# Altium schematic sheet SX1278.SchDoc
size A2
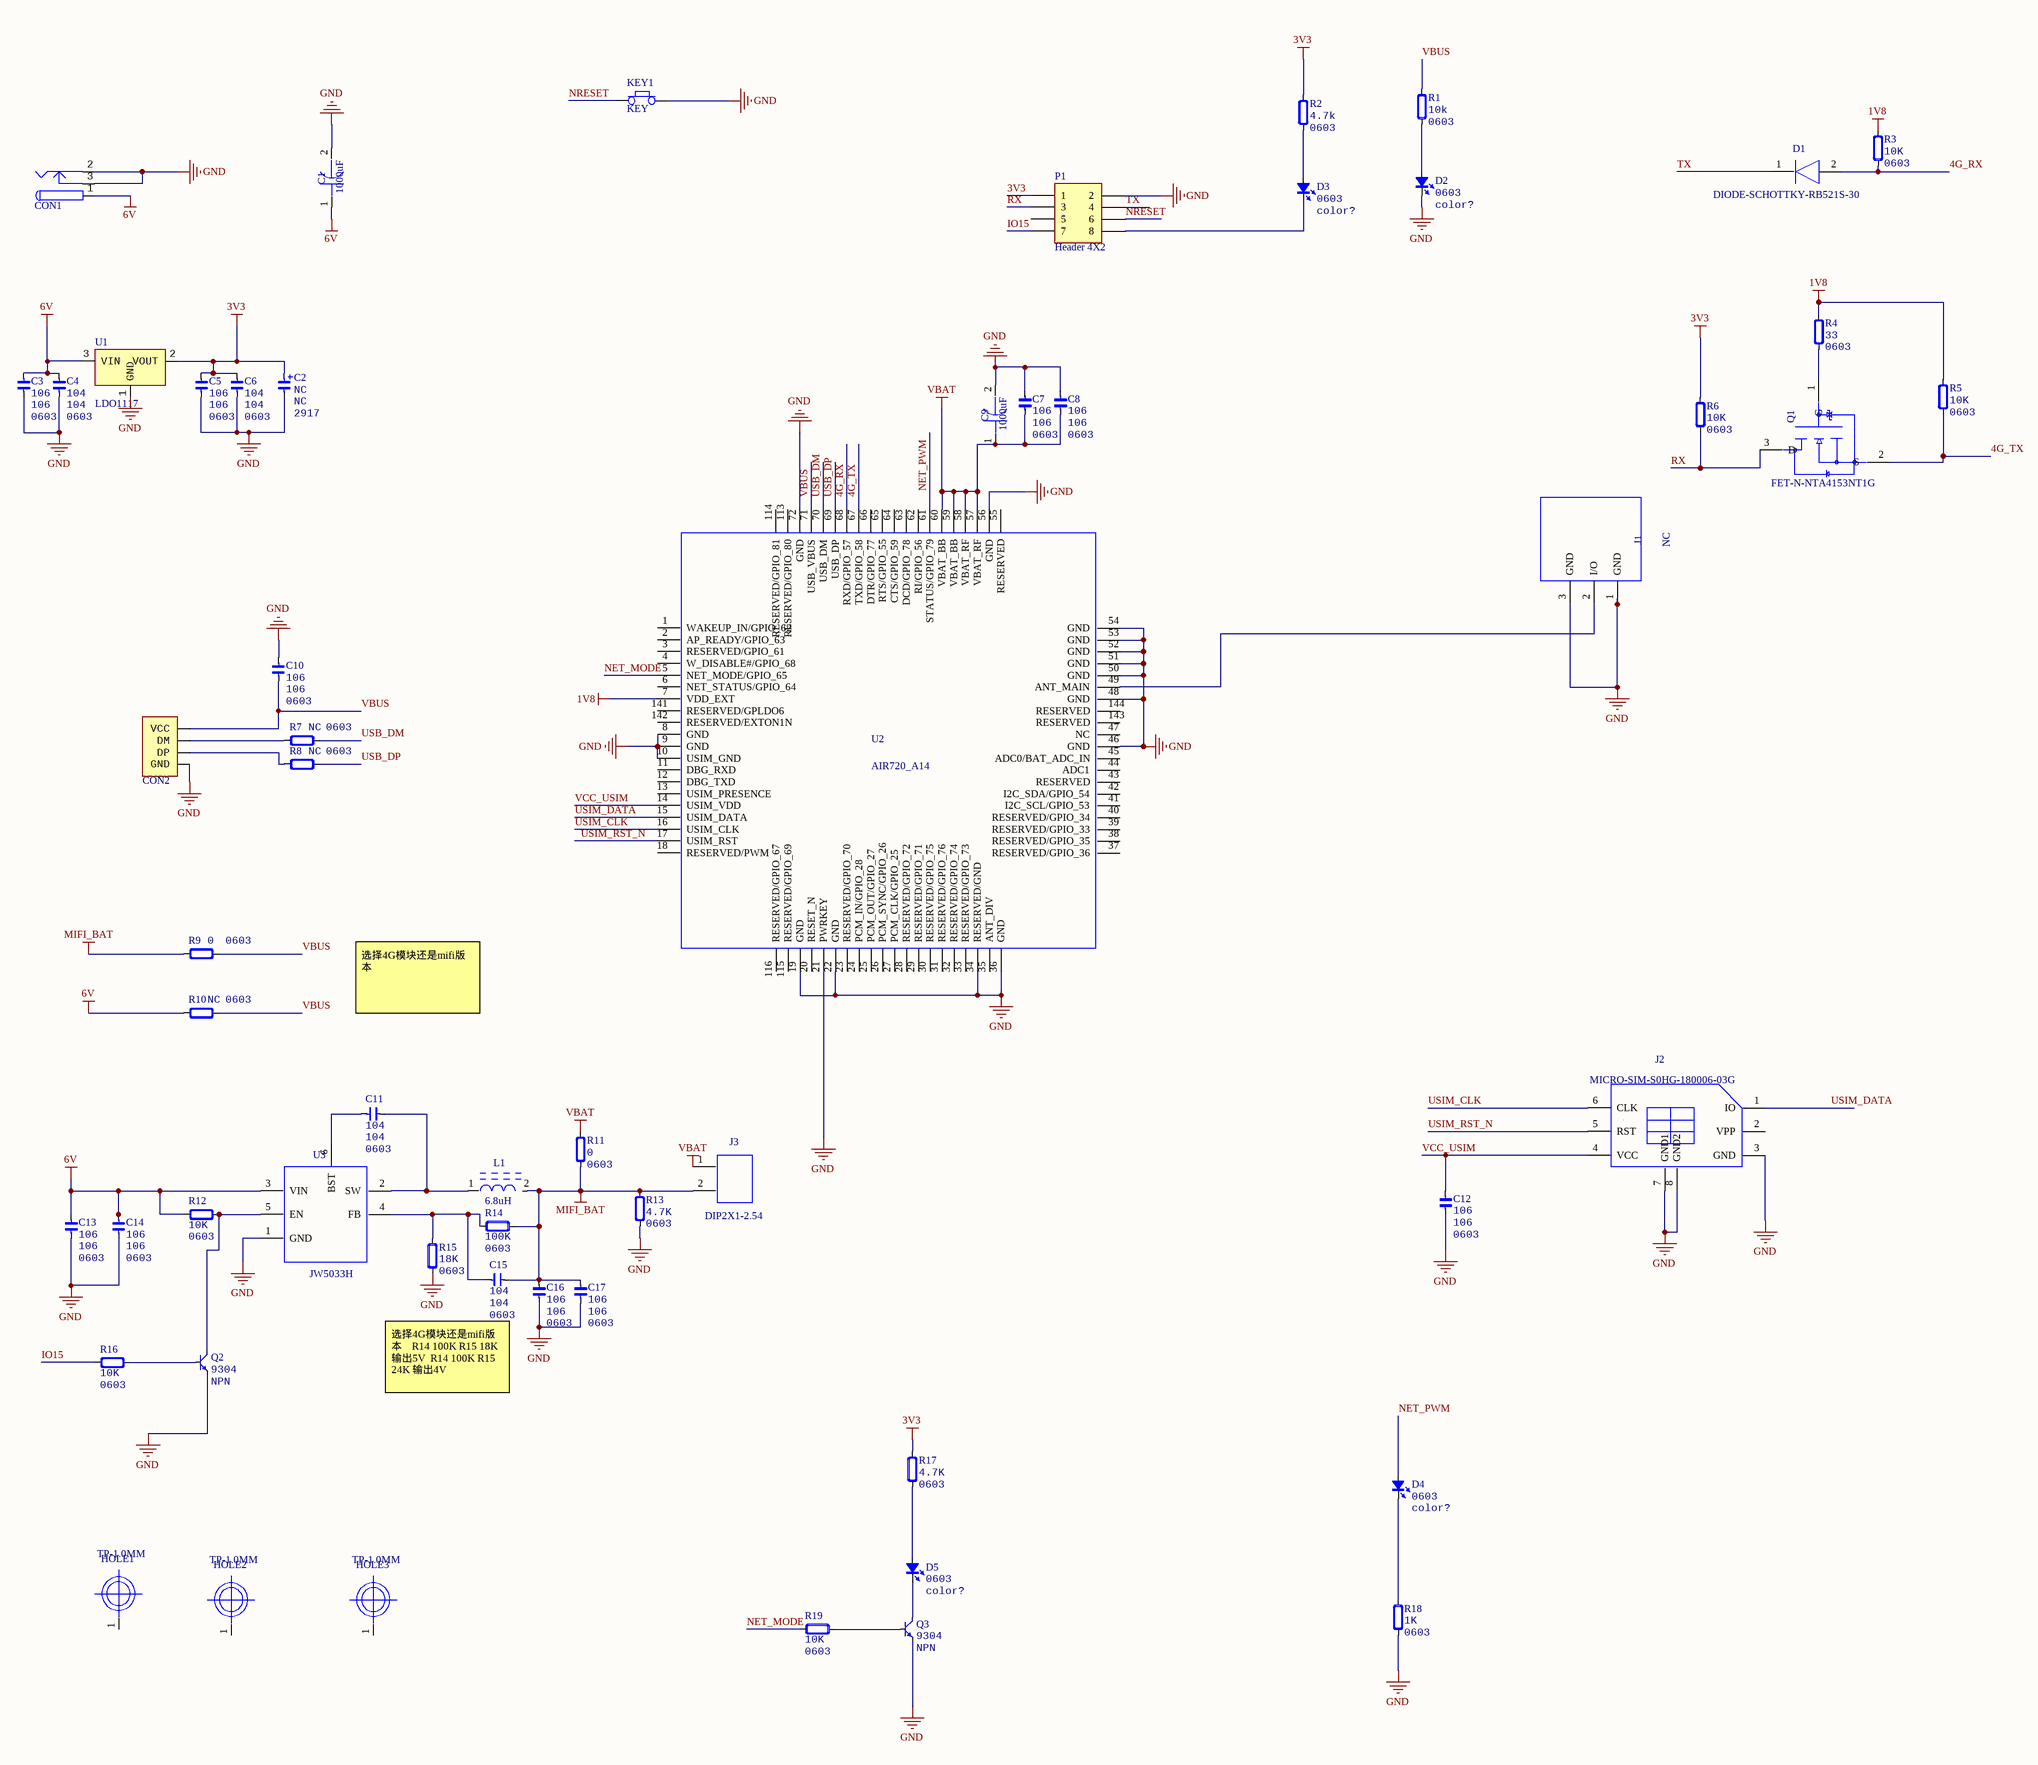
[diagram p0: SX1278.SchDoc]

## Parts
C1  value 1000uF  [CAP-AL-1000UF-10X12]  (hidden comment: CAP-AL-1000UF-8X10.5)
C2  NC  Type: 2917  [CAP_TAN_D2917]
C3  106  Type: 0603  [CAP_0603]
C4  104  Type: 0603  [CAP_0603]
C5  106  Type: 0603  [CAP_0603]
C6  104  Type: 0603  [CAP_0603]
C7  106  Type: 0603  [CAP_0603]
C8  106  Type: 0603  [CAP_0603]
C9  value 1000uF  [CAP-AL-1000UF-10X12]  (hidden comment: CAP-AL-1000UF-8X10.5)
C10  106  Type: 0603  [CAP_0603]
C11  104  Type: 0603  [CAP_0603]
C12  106  Type: 0603  [CAP_0603]
C13  106  Type: 0603  [CAP_0603]
C14  106  Type: 0603  [CAP_0603]
C15  104  Type: 0603  [CAP_0603]
C16  106  Type: 0603  [CAP_0603]
C17  106  Type: 0603  [CAP_0603]
CON1  PowerJack_2.5  [DC003A]  (value not drawn)
CON2  USB_TypeA  [USB_TypeA]  (value not drawn)
D1  DIODE-SCHOTTKY-RB521S-30  [SOD523(RB521S)]
D2  Type: 0603  [LED_0603_GREEN]  (hidden comment: color?)
D3  Type: 0603  [LED_0603_GREEN]  (hidden comment: color?)
D4  Type: 0603  [LED_0603_GREEN]  (hidden comment: color?)
D5  Type: 0603  [LED_0603_GREEN]  (hidden comment: color?)
HOLE1  TP-1.0MM  [TP-1MM]
HOLE2  TP-1.0MM  [TP-1MM]
HOLE3  TP-1.0MM  [TP-1MM]
J1  NC  [RF-ANT-HJ]
J2  MICRO-SIM-S0HG-180006-03G  [S0HG-180006-03G]
J3  DIP2X1-2.54  [DIP2X1-2.54]
KEY1  KEY  [key_4]
L1  value 6.8uH  [LVS505020-4R7M-N]  (hidden comment: LVS505020-4R7M-N)
P1  Header 4X2  [HDR2X4]
Q1  FET-N-NTA4153NT1G  [SOT23-3]
Q2  Type: NPN  [SOT23-3]  (hidden comment: 9304)
Q3  Type: NPN  [SOT23-3]  (hidden comment: 9304)
R1  Type: 0603  [RES_0603]  (hidden comment: 10k)
R2  Type: 0603  [RES_0603]  (hidden comment: 4.7k)
R3  Type: 0603  [RES_0603]  (hidden comment: 10K)
R4  Type: 0603  [RES_0603]  (hidden comment: 33)
R5  Type: 0603  [RES_0603]  (hidden comment: 10K)
R6  Type: 0603  [RES_0603]  (hidden comment: 10K)
R7  Type: 0603  [RES_0603]  (hidden comment: NC)
R8  Type: 0603  [RES_0603]  (hidden comment: NC)
R9  Type: 0603  [RES_0603]  (hidden comment: 0)
R10  Type: 0603  [RES_0603]  (hidden comment: NC)
R11  Type: 0603  [RES_0603]  (hidden comment: 0)
R12  Type: 0603  [RES_0603]  (hidden comment: 10K)
R13  Type: 0603  [RES_0603]  (hidden comment: 4.7K)
R14  Type: 0603  [RES_0603]  (hidden comment: 100K)
R15  Type: 0603  [RES_0603]  (hidden comment: 18K)
R16  Type: 0603  [RES_0603]  (hidden comment: 10K)
R17  Type: 0603  [RES_0603]  (hidden comment: 4.7K)
R18  Type: 0603  [RES_0603]  (hidden comment: 1K)
R19  Type: 0603  [RES_0603]  (hidden comment: 10K)
U1  LDO1117  [SOT223-3]
U2  AIR720_A14  [AIR726-A]
U3  JW5033H  [JW5033S]

## Nets
1V8: R3.1 R4.1 R5.1 U2.7(VDD_EXT)
3V3: C2.1 C5.2 C6.2 P1.1 R2.1 R6.1 R17.2 U1.2(VOUT)
6V: C1.1 C3.2 C4.2 C13.2 C14.2 CON1.1 R10.1 R12.1 U1.3(VIN) U3.3(VIN)
GND: C1.2 C2.2 C3.1 C4.1 C5.1 C6.1 C7.2 C8.2 C9.2 C10.1 C12.1 C13.1 C14.1 C16.1 C17.1 CON1.2 CON1.3 CON2.4(GND) D2.2(K) J1.1(GND) J1.3(GND) J2.3(GND) J2.7(GND1) J2.8(GND2) KEY1.2 P1.2 Q2.2(E) Q3.2(E) R13.1 R15.1 R18.1 U1.1(GND) U2.8(GND) U2.9(GND) U2.10(USIM_GND) U2.19(GND) U2.21(PWRKEY) U2.22(GND) U2.34(RESERVED/GND) U2.36(GND) U2.46(GND) U2.48(GND) U2.50(GND) U2.51(GND) U2.52(GND) U2.53(GND) U2.54(GND) U2.56(GND) U2.72(GND) U2.85(GND) U2.86(GND) U2.87(GND) U2.88(GND) U2.89(GND) U2.90(GND) U2.91(GND) U2.92(GND) U2.93(GND) U2.94(GND) U2.95(GND) U2.96(GND) U2.97(GND) U2.98(GND) U2.99(GND) U2.100(GND) U2.101(GND) U2.102(GND) U2.103(GND) U2.104(GND) U2.105(GND) U2.106(GND) U2.107(GND) U2.108(GND) U2.109(GND) U2.110(GND) U2.111(GND) U2.112(GND) U3.1(GND)
MIFI_BAT: C15.2 C16.2 C17.2 J3.2 L1.2 R9.1 R11.1 R13.2 R14.2
VBAT: C7.1 C8.1 C9.1 J3.1 R11.2 U2.57(VBAT_RF) U2.58(VBAT_RF) U2.59(VBAT_BB) U2.60(VBAT_BB)
4G_RX: D1.2 R3.2 U2.68(RXD/GPIO_57)
4G_TX: Q1.2(S) R5.2 U2.67(TXD/GPIO_58)
IO15: P1.7 R16.1
NET_MODE: R19.1 U2.5(NET_MODE/GPIO_65)
NET_PWM: D4.1(A) U2.61(STATUS/GPIO_79)
NRESET: KEY1.1 P1.6
RX: P1.3 Q1.3(D) R6.2
TX: D1.1 P1.4
USB_DM: R7.2 U2.70(USB_DM)
USB_DP: R8.2 U2.69(USB_DP)
USIM_CLK: J2.6(CLK) U2.16(USIM_CLK)
USIM_DATA: J2.1(IO) U2.15(USIM_DATA)
USIM_RST_N: J2.5(RST) U2.17(USIM_RST)
VBUS: C10.2 CON2.1(VCC) R1.1 R9.2 R10.2 U2.71(USB_VBUS)
VCC_USIM: C12.2 J2.4(VCC) U2.14(USIM_VDD)
NetC11_1: C11.1 L1.1 U3.2(SW)
NetC11_2: C11.2 U3.6(BST)
NetC15_1: C15.1 R14.1 R15.2 U3.4(FB)
NetCON2_2: CON2.2(DM) R7.1
NetCON2_3: CON2.3(DP) R8.1
NetD2_1: D2.1(A) R1.2
NetD3_1: D3.1(A) R2.2
NetD3_2: D3.2(K) P1.8
NetD4_2: D4.2(K) R18.2
NetD5_1: D5.1(A) R17.1
NetD5_2: D5.2(K) Q3.3(C)
NetJ1_2: J1.2(I/O) U2.49(ANT_MAIN)
NetQ1_1: Q1.1(G) R4.2
NetQ2_1: Q2.1(B) R16.2
NetQ2_3: Q2.3(C) R12.2 U3.5(EN)
NetQ3_1: Q3.1(B) R19.2

Not connected (* = marked no-connect by the designer): HOLE1 1; HOLE2 1; HOLE3 1; J2 2(VPP); P1 5; U2 1(WAKEUP_IN/GPIO_62) 2(AP_READY/GPIO_63) 3(RESERVED/GPIO_61) 4(W_DISABLE#/GPIO_68) 6(NET_STATUS/GPIO_64) 11(DBG_RXD) 12(DBG_TXD) 13(USIM_PRESENCE) 18(RESERVED/PWM) 20(RESET_N) 23(RESERVED/GPIO_70) 24(PCM_IN/GPIO_28) 25(PCM_OUT/GPIO_27) 26(PCM_SYNC/GPIO_26) 27(PCM_CLK/GPIO_25) 28(RESERVED/GPIO_72) 29(RESERVED/GPIO_71) 30(RESERVED/GPIO_75) 31(RESERVED/GPIO_76) 32(RESERVED/GPIO_74) 33(RESERVED/GPIO_73) 35(ANT_DIV) 37(RESERVED/GPIO_36) 38(RESERVED/GPIO_35) 39(RESERVED/GPIO_33) 40(RESERVED/GPIO_34) 41(I2C_SCL/GPIO_53) 42(I2C_SDA/GPIO_54) 43(RESERVED) 44(ADC1) 45(ADC0/BAT_ADC_IN) 47(NC) 55(RESERVED) 62(RI/GPIO_56) 63(DCD/GPIO_78) 64(CTS/GPIO_59) 65(RTS/GPIO_55) 66(DTR/GPIO_77) 113(RESERVED/GPIO_80) 114(RESERVED/GPIO_81) 115(RESERVED/GPIO_69) 116(RESERVED/GPIO_67) 141(RESERVED/GPLDO6) 142(RESERVED/EXTON1N) 143(RESERVED) 144(RESERVED)

## Notes on the sheet
- 选择4G模块还是mifi版本
- 选择4G模块还是mifi版本    R14 100K R15 18K 输出5V  R14 100K R15 24K 输出4V
- Title
- Size:
- Date:
- File:
- A2
- Number:
- Time:
- Revision:
- Sheet
- of

## Library data of the parts
C1 C9 = CAP-AL-1000UF-8X10.5: 贴片电解电容,1000uF/10V; Geometry.Height: 10.4 mm; PCB DECAL: CAP-AL-1000UF-8X10.5
C2 = Cap_Tan_2917: Capacitor Tantalum; Value: NC
C3-C8 C10-C17 = Cap_0603: Capacitor
  C3 C5 C7 C8 C10 C12-C14 C16 C17: Value: 106
  C4 C6 C11 C15: Value: 104
CON1 = PowerJack_2.5: DC Power Jack
CON2 = USB_TypeA: USB
D1 = DIODE-SCHOTTKY-RB521S-30: Schottky Diode;30V;200mA/0.6V;SOD-523;0.7mm;ROHS; Manufacture 1: Panjit;WILL;KEC;Onsemi;; Manufacture 1 P/N: RB521S30T1G;KDR730E;RB521S30-2/TR;RB521S30/TR; Serial Number: 81210000004; Geometry.Height: 0.7mm; PCB DECAL: SOD523(RB521S)
D2-D5 = LED_0603: LED; Value: color?
HOLE1-HOLE3 = TP-1.0MM: TP-1mm; Geometry.Height: 0.05mm; PCB DECAL: TP-1MM
J1 = RF-ANT-SOCKET-U.FL-R-SMT: RF CONNECTOR;3*3*1.25mm;ROHS; Part Number: 1120333002051; Manufacture 1: Hirose; Geometry.Height: 1.25mm; Serial Number: 80830000004; Manufacture 1 P/N: U.FL-R-SMT; PCB DECAL: RF-ANT-SOCKET-U.FL-R-SMT
J2 = MICRO-SIM-S0HG-180006-03G: 1.8H掀盖 Micro SIM卡座;16.3*14.66*1.8mm; Manufacture 1: 深圳市精睿兴业科技有限公司; Geometry.Height: 1.8mm; Manufacture 1 P/N: S0HG-180006-03G; PCB DECAL: S0HG-180006-03G
J3 = DIP2X1-2.54: Geometry.Height: 2mm; PCB DECAL: DIP2X1-2.54
L1 = LVS505020-4R7M-N: Manufacture 1: Chilisin(奇力新); Geometry.Height: 2.2 mm; PCB DECAL: LVS505020-4R7M-N
P1 = Header 4X2: Header, 4-Pin, Dual row; LatestRevisionDate: 17-Jul-2002; LatestRevisionNote: Re-released for DXP Platform.; Publisher: Altium Limited
Q1 = FET-N-NTA4153NT1G: MOSFET;N-Ch; Manufacture 1 P/N: WNM2030; Geometry.Height: 0.55mm; PCB DECAL: SOT-723
Q2 Q3 = BJT_NPN: Transistor; Value: 9304
R1-R19 = Res_0603: Resistor
  R1: Value: 10k
  R2: Value: 4.7k
  R3 R5 R6 R12 R16 R19: Value: 10K
  R4: Value: 33
  R7 R8 R10: Value: NC
  R9 R11: Value: 0
  R13 R17: Value: 4.7K
  R14: Value: 100K
  R15: Value: 18K
  R18: Value: 1K
U1 = LDO1117: Power; Type: SOT223-3
U2 = AIR720_A14: PCB DECAL: AIR726
U3 = JW5033H: Geometry.Height: 1.1mm; PCB DECAL: JW5033S